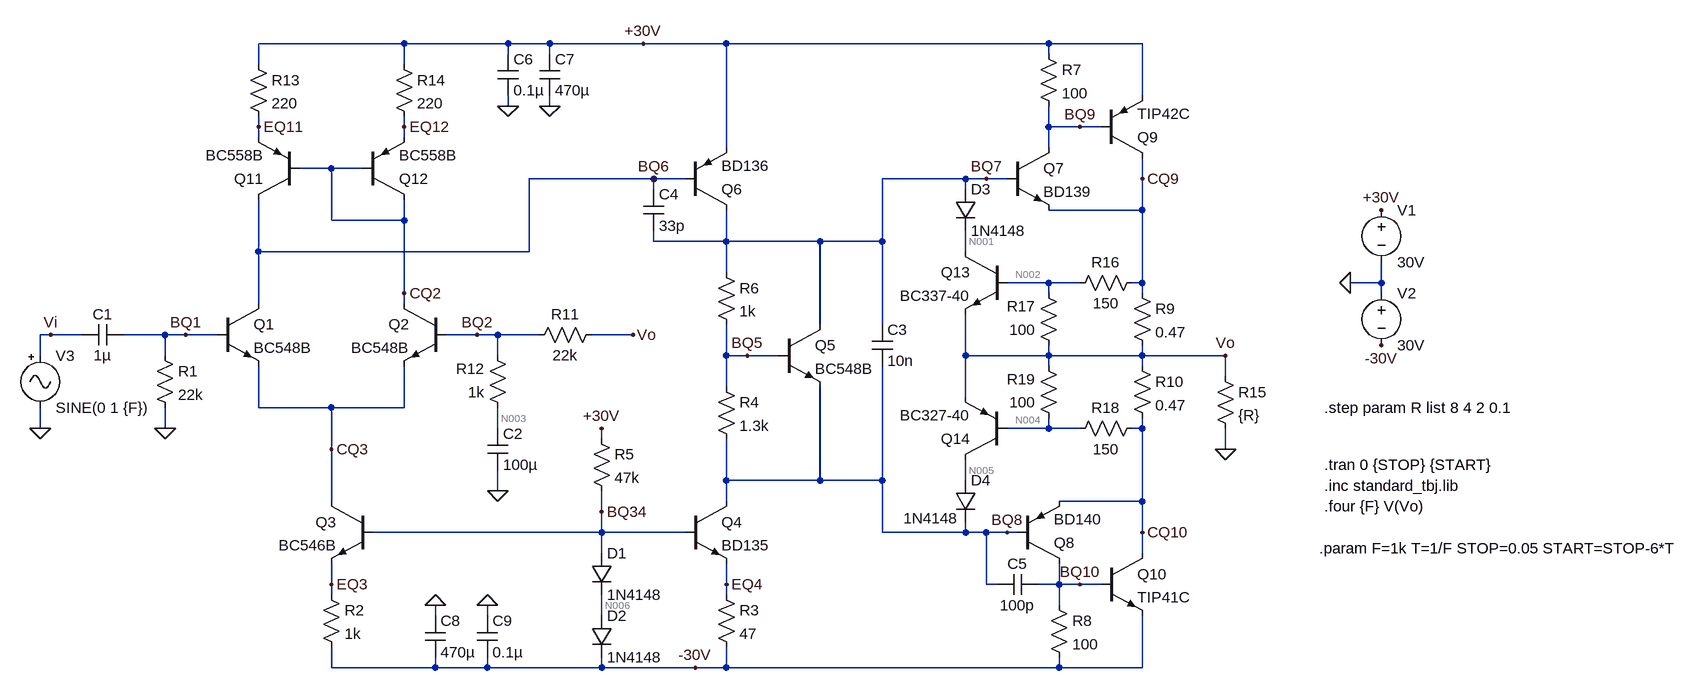
[diagram p0: schematic Clase_B_con_proteccion.asc]
Clase_B_con_proteccion.asc, the LTspice schematic file:
Version 4
SHEET 1 2480 1108
WIRE 96 -224 -128 -224
WIRE 256 -224 96 -224
WIRE 320 -224 256 -224
WIRE 464 -224 320 -224
WIRE 592 -224 464 -224
WIRE 1088 -224 592 -224
WIRE 1232 -224 1088 -224
WIRE 256 -208 256 -224
WIRE 320 -208 320 -224
WIRE 1088 -208 1088 -224
WIRE -128 -192 -128 -224
WIRE 96 -192 96 -224
WIRE 1232 -144 1232 -224
WIRE 256 -128 256 -144
WIRE 320 -128 320 -144
WIRE -128 -96 -128 -112
WIRE 96 -96 96 -112
WIRE 1088 -96 1088 -128
WIRE 1136 -96 1088 -96
WIRE 1168 -96 1136 -96
WIRE -128 -80 -128 -96
WIRE 96 -80 96 -96
WIRE 592 -64 592 -224
WIRE 1088 -64 1088 -96
WIRE -16 -32 -64 -32
WIRE 32 -32 -16 -32
WIRE 480 -16 288 -16
WIRE 528 -16 480 -16
WIRE 960 -16 832 -16
WIRE 992 -16 960 -16
WIRE 1024 -16 992 -16
WIRE 1232 -16 1232 -48
WIRE 480 0 480 -16
WIRE 960 0 960 -16
WIRE 1232 32 1232 -16
WIRE 1232 32 1088 32
WIRE -16 48 -16 -32
WIRE 96 48 96 16
WIRE 96 48 -16 48
WIRE 480 80 480 64
WIRE 592 80 592 32
WIRE 592 80 480 80
WIRE 736 80 592 80
WIRE 832 80 832 -16
WIRE 832 80 736 80
WIRE -128 96 -128 16
WIRE 288 96 288 -16
WIRE 288 96 -128 96
WIRE 960 96 960 64
WIRE 592 128 592 80
WIRE 1088 144 1024 144
WIRE 1136 144 1088 144
WIRE 1232 144 1232 32
WIRE 1232 144 1216 144
WIRE 1600 144 1600 112
WIRE 1600 144 1552 144
WIRE 96 160 96 48
WIRE 1088 160 1088 144
WIRE 1232 160 1232 144
WIRE 1600 160 1600 144
WIRE -128 176 -128 96
WIRE 96 176 96 160
WIRE 736 208 736 80
WIRE 832 208 832 80
WIRE -448 224 -464 224
WIRE -400 224 -448 224
WIRE -272 224 -336 224
WIRE -240 224 -272 224
WIRE -192 224 -240 224
WIRE 208 224 160 224
WIRE 240 224 208 224
WIRE 304 224 240 224
WIRE 448 224 384 224
WIRE -464 256 -464 224
WIRE -272 256 -272 224
WIRE 240 256 240 224
WIRE 592 256 592 208
WIRE 624 256 592 256
WIRE 672 256 624 256
WIRE 960 256 960 192
WIRE 1088 256 1088 240
WIRE 1088 256 960 256
WIRE 1232 256 1232 240
WIRE 1232 256 1088 256
WIRE 1360 256 1232 256
WIRE 1088 272 1088 256
WIRE 1232 272 1232 256
WIRE 1360 288 1360 256
WIRE 592 304 592 256
WIRE 960 320 960 256
WIRE -128 336 -128 272
WIRE -16 336 -128 336
WIRE 96 336 96 272
WIRE 96 336 -16 336
WIRE -464 368 -464 336
WIRE -272 368 -272 336
WIRE 240 368 240 336
WIRE 1088 368 1088 352
WIRE 1088 368 1024 368
WIRE 1136 368 1088 368
WIRE 1232 368 1232 352
WIRE 1232 368 1216 368
WIRE 400 384 400 368
WIRE -16 400 -16 336
WIRE 1360 400 1360 368
WIRE 592 448 592 384
WIRE 736 448 736 304
WIRE 736 448 592 448
WIRE 832 448 832 272
WIRE 832 448 736 448
WIRE 960 448 960 416
WIRE 240 464 240 432
WIRE -16 480 -16 400
WIRE 592 480 592 448
WIRE 1232 480 1232 368
WIRE 1232 480 1104 480
WIRE 400 496 400 464
WIRE 400 528 400 496
WIRE 400 528 48 528
WIRE 528 528 400 528
WIRE 832 528 832 448
WIRE 960 528 960 512
WIRE 960 528 832 528
WIRE 992 528 960 528
WIRE 1024 528 992 528
WIRE 1040 528 1024 528
WIRE 1232 528 1232 480
WIRE 400 560 400 528
WIRE 1232 560 1232 528
WIRE -16 608 -16 576
WIRE 592 608 592 576
WIRE 992 608 992 528
WIRE 1008 608 992 608
WIRE 1104 608 1104 576
WIRE 1104 608 1072 608
WIRE 1136 608 1104 608
WIRE 1168 608 1136 608
WIRE -16 624 -16 608
WIRE 592 624 592 608
WIRE 1104 640 1104 608
WIRE 144 656 144 640
WIRE 224 656 224 640
WIRE 400 656 400 624
WIRE -16 736 -16 704
WIRE 144 736 144 720
WIRE 144 736 -16 736
WIRE 224 736 224 720
WIRE 224 736 144 736
WIRE 400 736 400 720
WIRE 400 736 224 736
WIRE 544 736 400 736
WIRE 592 736 592 704
WIRE 592 736 544 736
WIRE 1104 736 1104 720
WIRE 1104 736 592 736
WIRE 1232 736 1232 656
WIRE 1232 736 1104 736
FLAG 1552 144 0
FLAG 1600 32 +30V
FLAG 464 -224 +30V
FLAG 1600 240 -30V
FLAG 544 736 -30V
FLAG 240 464 0
FLAG -464 368 0
FLAG 1360 256 Vo
FLAG -448 224 Vi
FLAG 480 -16 BQ6
FLAG -16 400 CQ3
FLAG -16 608 EQ3
FLAG 400 496 BQ34
FLAG 592 608 EQ4
FLAG 992 -16 BQ7
FLAG 1024 528 BQ8
FLAG 1136 -96 BQ9
FLAG 1136 608 BQ10
FLAG 1232 528 CQ10
FLAG 1232 -16 CQ9
FLAG -272 368 0
FLAG 448 224 Vo
FLAG -128 -96 EQ11
FLAG 96 -96 EQ12
FLAG 96 160 CQ2
FLAG 208 224 BQ2
FLAG -240 224 BQ1
FLAG 624 256 BQ5
FLAG 1360 400 0
FLAG 400 368 +30V
FLAG 320 -128 0
FLAG 144 640 0
FLAG 256 -128 0
FLAG 224 640 0
SYMBOL npn -192 176 R0
SYMATTR InstName Q1
SYMATTR Value BC548B
SYMBOL npn 160 176 M0
SYMATTR InstName Q2
SYMATTR Value BC548B
SYMBOL npn 48 480 M0
SYMATTR InstName Q3
SYMATTR Value BC546B
SYMBOL npn 528 480 R0
SYMATTR InstName Q4
SYMATTR Value BD135
SYMBOL npn 672 208 R0
SYMATTR InstName Q5
SYMATTR Value BC548B
SYMBOL pnp 528 32 M180
SYMATTR InstName Q6
SYMATTR Value BD136
SYMBOL res 576 112 R0
SYMATTR InstName R6
SYMATTR Value 1k
SYMBOL res 576 288 R0
SYMATTR InstName R4
SYMATTR Value 1.3k
SYMBOL diode 384 560 R0
SYMATTR InstName D1
SYMATTR Value 1N4148
SYMBOL diode 384 656 R0
SYMATTR InstName D2
SYMATTR Value 1N4148
SYMBOL res -32 608 R0
SYMATTR InstName R2
SYMATTR Value 1k
SYMBOL res 576 608 R0
SYMATTR InstName R3
SYMATTR Value 47
SYMBOL res 384 368 R0
SYMATTR InstName R5
SYMATTR Value 47k
SYMBOL voltage 1600 16 R0
WINDOW 123 0 0 Left 2
WINDOW 39 0 0 Left 2
SYMATTR InstName V1
SYMATTR Value 30V
SYMBOL voltage 1600 144 R0
SYMATTR InstName V2
SYMATTR Value 30V
SYMBOL res 1216 144 R0
SYMATTR InstName R9
SYMATTR Value 0.47
SYMBOL res 1216 256 R0
SYMATTR InstName R10
SYMATTR Value 0.47
SYMBOL npn 1024 -64 R0
SYMATTR InstName Q7
SYMATTR Value BD139
SYMBOL pnp 1168 -48 M180
SYMATTR InstName Q9
SYMATTR Value TIP42C
SYMBOL res 1072 -224 R0
SYMATTR InstName R7
SYMATTR Value 100
SYMBOL pnp 1040 576 M180
SYMATTR InstName Q8
SYMATTR Value BD140
SYMBOL npn 1168 560 R0
SYMATTR InstName Q10
SYMATTR Value TIP41C
SYMBOL res 1088 624 R0
SYMATTR InstName R8
SYMATTR Value 100
SYMBOL res 400 208 R90
WINDOW 0 0 56 VBottom 2
WINDOW 3 32 56 VTop 2
SYMATTR InstName R11
SYMATTR Value 22k
SYMBOL res 256 352 R180
WINDOW 0 36 76 Left 2
WINDOW 3 36 40 Left 2
SYMATTR InstName R12
SYMATTR Value 1k
SYMBOL cap 464 0 R0
SYMATTR InstName C4
SYMATTR Value 33p
SYMBOL cap 224 368 R0
SYMATTR InstName C2
SYMATTR Value 100µ
SYMBOL cap -400 240 R270
WINDOW 0 32 32 VTop 2
WINDOW 3 0 32 VBottom 2
SYMATTR InstName C1
SYMATTR Value 1µ
SYMBOL res -288 240 R0
SYMATTR InstName R1
SYMATTR Value 22k
SYMBOL pnp -64 16 R180
SYMATTR InstName Q11
SYMATTR Value BC558B
SYMBOL pnp 32 16 M180
SYMATTR InstName Q12
SYMATTR Value BC558B
SYMBOL res -144 -208 R0
SYMATTR InstName R13
SYMATTR Value 220
SYMBOL res 80 -208 R0
SYMATTR InstName R14
SYMATTR Value 220
SYMBOL cap 1072 592 R90
WINDOW 0 0 32 VBottom 2
WINDOW 3 32 32 VTop 2
SYMATTR InstName C5
SYMATTR Value 100p
SYMBOL res 1344 272 R0
SYMATTR InstName R15
SYMATTR Value {R}
SYMBOL cap 816 208 R0
SYMATTR InstName C3
SYMATTR Value 10n
SYMBOL cap 304 -208 R0
SYMATTR InstName C7
SYMATTR Value 470µ
SYMBOL cap 128 656 R0
SYMATTR InstName C8
SYMATTR Value 470µ
SYMBOL Misc\\signal -464 240 R0
WINDOW 123 0 0 Left 0
WINDOW 39 0 0 Left 0
SYMATTR InstName V3
SYMATTR Value SINE(0 1 {F})
SYMBOL res 1232 128 R90
WINDOW 0 0 56 VBottom 2
WINDOW 3 32 56 VTop 2
SYMATTR InstName R16
SYMATTR Value 150
SYMBOL res 1104 256 R180
WINDOW 0 36 76 Left 2
WINDOW 3 36 40 Left 2
SYMATTR InstName R17
SYMATTR Value 100
SYMBOL res 1120 384 R270
WINDOW 0 32 56 VTop 2
WINDOW 3 0 56 VBottom 2
SYMATTR InstName R18
SYMATTR Value 150
SYMBOL res 1104 368 R180
WINDOW 0 36 76 Left 2
WINDOW 3 36 40 Left 2
SYMATTR InstName R19
SYMATTR Value 100
SYMBOL npn 1024 96 M0
SYMATTR InstName Q13
SYMATTR Value BC337-40
SYMBOL pnp 1024 416 R180
SYMATTR InstName Q14
SYMATTR Value BC327-40
SYMBOL diode 944 0 R0
SYMATTR InstName D3
SYMATTR Value 1N4148
SYMBOL diode 944 448 R0
WINDOW 3 -80 58 Left 2
SYMATTR Value 1N4148
SYMATTR InstName D4
SYMBOL cap 240 -208 R0
SYMATTR InstName C6
SYMATTR Value 0.1µ
SYMBOL cap 208 656 R0
SYMATTR InstName C9
SYMATTR Value 0.1µ
TEXT 1512 456 Left 2 !.inc standard_tbj.lib
TEXT 1512 488 Left 2 !.four {F} V(Vo)
TEXT 1504 552 Left 2 !.param F=1k T=1/F STOP=0.05 START=STOP-6*T
TEXT 1512 424 Left 2 !.tran 0 {STOP} {START}
TEXT 1512 336 Left 2 !.step param R list 8 4 2 0.1

The netlist it stands for:
* Clase_B_con_proteccion.asc
Q1 BQ6 BQ1 CQ3 0 BC548B
Q2 CQ2 BQ2 CQ3 0 BC548B
Q3 CQ3 BQ34 EQ3 0 BC546B
Q4 BQ8 BQ34 EQ4 0 BD135
Q5 BQ7 BQ5 BQ8 0 BC548B
Q6 BQ7 BQ6 +30V 0 BD136
R6 BQ7 BQ5 1k
R4 BQ5 BQ8 1.3k
D1 BQ34 N006 1N4148
D2 N006 -30V 1N4148
R2 EQ3 -30V 1k
R3 EQ4 -30V 47
R5 +30V BQ34 47k
V1 +30V 0 30V
V2 0 -30V 30V
R9 CQ9 Vo 0.47
R10 Vo CQ10 0.47
Q7 BQ9 BQ7 CQ9 0 BD139
Q9 CQ9 BQ9 +30V 0 TIP42C
R7 +30V BQ9 100
Q8 BQ10 BQ8 CQ10 0 BD140
Q10 CQ10 BQ10 -30V 0 TIP41C
R8 BQ10 -30V 100
R11 Vo BQ2 22k
R12 N003 BQ2 1k
C4 BQ6 BQ7 33p
C2 N003 0 100µ
C1 Vi BQ1 1µ
R1 BQ1 0 22k
Q11 BQ6 CQ2 EQ11 0 BC558B
Q12 CQ2 CQ2 EQ12 0 BC558B
R13 +30V EQ11 220
R14 +30V EQ12 220
C5 BQ10 BQ8 100p
R15 Vo 0 {R}
C3 BQ7 BQ8 10n
C7 +30V 0 470µ
C8 0 -30V 470µ
V3 Vi 0 SINE(0 1 {F})
R16 CQ9 N002 150
R17 Vo N002 100
R18 N004 CQ10 150
R19 N004 Vo 100
Q13 N001 N002 Vo 0 BC337-40
Q14 N005 N004 Vo 0 BC327-40
D3 BQ7 N001 1N4148
D4 N005 BQ8 1N4148
C6 +30V 0 0.1µ
C9 0 -30V 0.1µ
.model D D
.lib standard.dio
.model NPN NPN
.model PNP PNP
.lib standard.bjt
.inc standard_tbj.lib
.four {F} V(Vo)
.param F=1k T=1/F STOP=0.05 START=STOP-6*T
.tran 0 {STOP} {START}
.step param R list 8 4 2 0.1
.backanno
.end

* Results of the author's LTspice run, read from the files saved beside the schematic
* Operating Point, zero values left out:
*   V(bq6) = 29.29 V
*   V(bq1) = -19.1 mV
*   V(cq3) = -643.1 mV
*   V(cq2) = 29.26 V
*   V(bq2) = -23.8 mV
*   V(bq34) = -28.81 V
*   V(eq3) = -29.43 V
*   V(bq8) = -663.7 mV
*   V(eq4) = -29.49 V
*   V(bq7) = 656 mV
*   V(bq5) = 63.05 mV
*   V(+30v) = 30 V
*   V(n006) = -29.41 V
*   V(-30v) = -30 V
*   V(cq9) = 34.15 mV
*   V(vo) = -7.495 mV
*   V(cq10) = -49.58 mV
*   V(bq9) = 29.29 V
*   V(bq10) = -29.4 V
*   V(n003) = -23.8 mV
*   V(eq11) = 29.94 V
*   V(eq12) = 29.94 V
*   V(n002) = 9.163 mV
*   V(n004) = -24.33 mV
*   V(n001) = 655.9 mV
*   V(n005) = -663.7 mV
*   Ic(Q14) = -1.351 pA
*   Ic(Q12) = -256.8 µA
*   Ib(Q12) = -870.2 nA
*   Ie(Q12) = 257.7 µA
*   Ic(Q11) = -256.8 µA
*   Ib(Q11) = -870.5 nA
*   Ie(Q11) = 257.6 µA
*   Ic(Q10) = 83.03 mA
*   Ib(Q10) = 656.3 µA
*   Ie(Q10) = -83.69 mA
*   Ic(Q8) = -6.647 mA
*   Ib(Q8) = -30.51 µA
*   Ie(Q8) = 6.678 mA
*   Ic(Q9) = -81.01 mA
*   Ib(Q9) = -583.9 µA
*   Ie(Q9) = 81.6 mA
*   Ic(Q7) = 7.728 mA
*   Ib(Q7) = 31.41 µA
*   Ie(Q7) = -7.76 mA
*   Ic(Q6) = -10.8 mA
*   Ib(Q6) = -53.26 µA
*   Ie(Q6) = 10.86 mA
*   Ic(Q4) = 10.8 mA
*   Ib(Q4) = 56.79 µA
*   Ie(Q4) = -10.86 mA
*   Ic(Q3) = 570.2 µA
*   Ib(Q3) = 1.384 µA
*   Ie(Q3) = -571.5 µA
*   Ic(Q5) = 10.18 mA
*   Ib(Q5) = 33.83 µA
*   Ie(Q5) = -10.21 mA
*   Ic(Q2) = 258.5 µA
*   Ib(Q2) = 741.3 nA
*   Ie(Q2) = -259.3 µA
*   Ic(Q1) = 310 µA
*   Ib(Q1) = 868.3 nA
*   Ie(Q1) = -310.9 µA
*   I(D4) = 1.351 pA
*   I(D2) = 1.193 mA
*   I(D1) = 1.193 mA
*   I(R19) = -168.3 µA
*   I(R18) = 168.3 µA
*   I(R17) = -166.6 µA
*   I(R16) = 166.6 µA
*   I(R15) = -936.9 µA
*   I(R14) = 257.7 µA
*   I(R13) = 257.6 µA
*   I(R1) = -868.3 nA
*   I(R11) = 741.3 nA
*   I(R8) = 5.991 mA
*   I(R7) = 7.144 mA
*   I(R10) = 89.54 mA
*   I(R9) = 88.61 mA
*   I(R5) = 1.251 mA
*   I(R3) = 10.86 mA
*   I(R2) = 571.5 µA
*   I(R4) = 559.1 µA
*   I(R6) = 592.9 µA
*   I(V2) = -102.3 mA
*   I(V1) = -101.4 mA
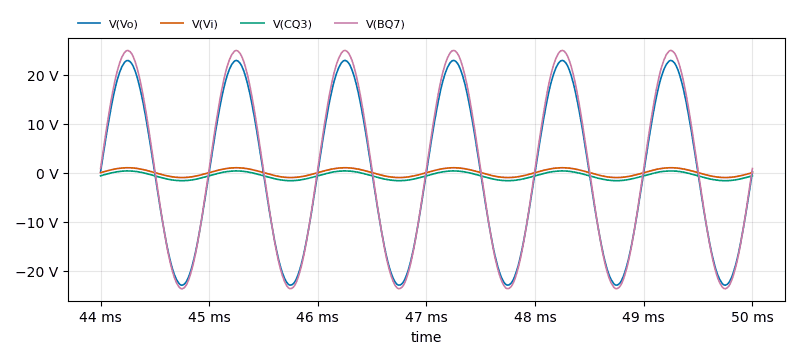
[diagram p1: Transient Analysis of Clase_B_con_proteccion.asc, plotted from the saved traces]
* Transient Analysis, 1 run:
*   V(Vo): min -22.95 V, max 22.89 V, average -31.19 mV, rms 16.19 V, last 164.8 mV
*   V(Vi): min -1 V, max 1 V, average -53.98 µV, rms 707 mV, last 0 V
*   V(CQ3): min -1.641 V, max 352.7 mV, average -644.2 mV, rms 954.4 mV, last -636.9 mV
*   V(BQ7): min -23.68 V, max 24.93 V, average 627.8 mV, rms 17.17 V, last 834.4 mV
* From the log:
*   N-Period=1
*   Fourier components of V(vo)
*   DC component:-0.0292048
*   Harmonic  Frequency   Fourier   Normalized   Phase    Normalized
*    Number     [Hz]     Component   Component  [degree]  Phase [deg]
*       1     1.000e+03  2.288e+01  1.000e+00      0.50°      0.00°
*       2     2.000e+03  1.022e-02  4.469e-04     80.74°     80.24°
*       3     3.000e+03  7.145e-03  3.123e-04     77.85°     77.35°
*       4     4.000e+03  2.932e-03  1.281e-04    -30.26°    -30.76°
*       5     5.000e+03  2.427e-02  1.061e-03    -95.25°    -95.74°
*       6     6.000e+03  6.391e-03  2.793e-04   -155.24°   -155.74°
*       7     7.000e+03  8.134e-03  3.556e-04    120.17°    119.68°
*       8     8.000e+03  1.459e-03  6.377e-05     65.86°     65.36°
*       9     9.000e+03  1.321e-02  5.774e-04    -13.12°    -13.61°
*   Total Harmonic Distortion: 0.140751%(0.148066%)